# EAGLE design untitled (EAGLE 5.10)
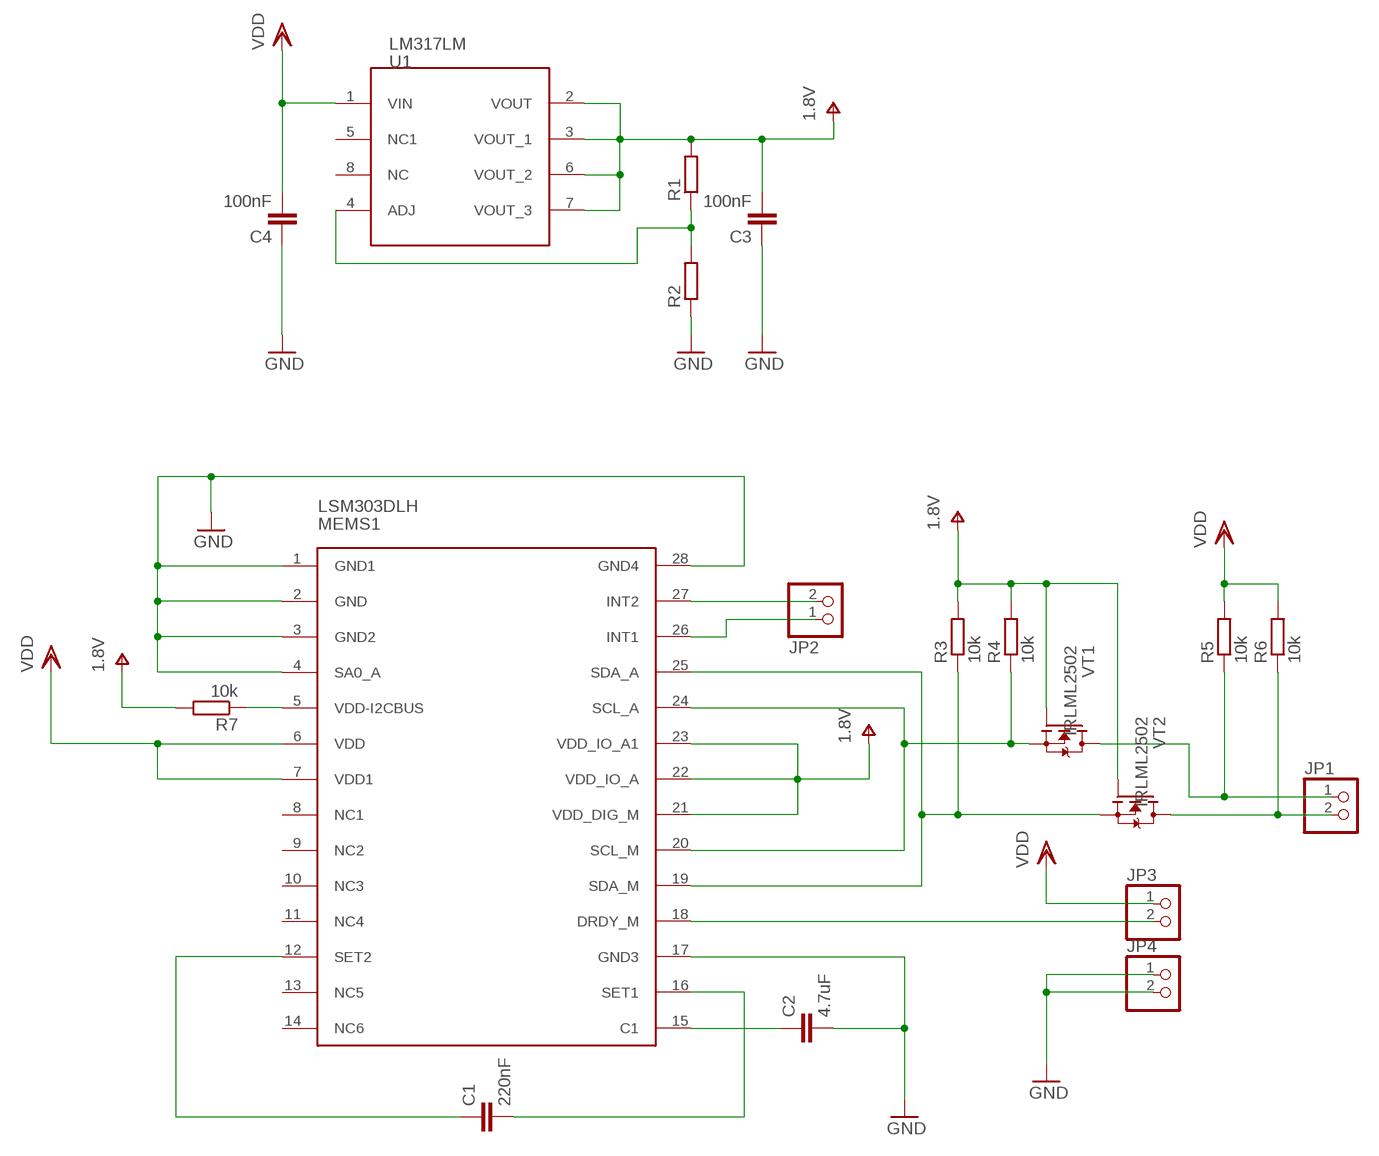
[diagram p0: schematic, sheet 1]

## Parts
C1  220nF  C-EUC1206  [C1206]
C2  4.7uF  C-EUC1206  [C1206]
C3  100nF  C-EUC1206  [C1206]
C4  100nF  C-EUC1206  [C1206]
JP1  PINHD-1X2  [1X02]
JP2  PINHD-1X2  [1X02]
JP3  PINHD-1X2  [1X02]
JP4  PINHD-1X2  [1X02]
MEMS1  LSM303DLH  [LGA28L]
R1  R-EU_R1206  [R1206]
R2  R-EU_R1206  [R1206]
R3  10k  R-EU_R1206  [R1206]
R4  10k  R-EU_R1206  [R1206]
R5  10k  R-EU_R1206  [R1206]
R6  10k  R-EU_R1206  [R1206]
R7  10k  R-EU_R1206  [R1206]
U1  LM317LM  [SO-08]
VT1  IRLML2502  [SOT23]
VT2  IRLML2502  [SOT23]

## Nets
DRDY_: JP3.2 MEMS1.18(DRDY_M)
GND: C2.2 C3.1 C4.1 JP4.1 JP4.2 MEMS1.1(GND1) MEMS1.2(GND) MEMS1.3(GND2) MEMS1.4(SA0_A) MEMS1.17(GND3) MEMS1.28(GND4) R2.1
INT1_: JP2.1 MEMS1.26(INT1)
INT2_: JP2.2 MEMS1.27(INT2)
N$2: C1.1 MEMS1.12(SET2)
N$3: C1.2 MEMS1.16(SET1)
N$4: C2.1 MEMS1.15(C1)
N$7: MEMS1.5(VDD-I2CBUS) R7.1
N$9: R1.1 R2.2 U1.4(ADJ)
N$11: MEMS1.20(SCL_M) MEMS1.24(SCL_A) R4.1 VT1.2(S)
N$13: MEMS1.19(SDA_M) MEMS1.25(SDA_A) R3.1 VT2.2(S)
SCL_: JP1.1 R5.1 VT1.3(D)
SDA_: JP1.2 R6.1 VT2.3(D)
V+: C3.2 MEMS1.21(VDD_DIG_M) MEMS1.22(VDD_IO_A) MEMS1.23(VDD_IO_A1) R1.2 R3.2 R4.2 R7.2 U1.2(VOUT) U1.3(VOUT_1) U1.6(VOUT_2) U1.7(VOUT_3) VT1.1(G) VT2.1(G) ; supply symbol labelled 1.8V
VDD: C4.2 JP3.1 MEMS1.6(VDD) MEMS1.7(VDD1) R5.2 R6.2 U1.1(VIN)
Unconnected: MEMS1.8(NC1) MEMS1.9(NC2) MEMS1.10(NC3) MEMS1.11(NC4) MEMS1.13(NC5) MEMS1.14(NC6) U1.5(NC1) U1.8(NC)

## Library data of the parts
C1-C4 = rcl:C-EU: CAPACITOR, European symbol
JP1-JP4 = pinhead:PINHD-1X2: PIN HEADER
MEMS1 = st-microelectronics:LSM303DLH
R1-R7 = rcl:R-EU_: RESISTOR, European symbol
U1 = poweric:LM317LM
VT1 VT2 = transistor-fet:IRLML2502: IRLML2502 Description These N-Channel MOSFETs from International Rectifier utilize advanced processing techniques to achieve extremely low on-resistance per silicon area. This benefit, combined with the fast switching speed and ruggedized device design that HEXFET power MOSFETs are well known for, provides the designer with an extremely efficient and reliable device for use in battery and load management. A thermally enhanced large pad leadframe has been incorporated into the standard SOT-23 package to produce Micro3 a HEXFET Power MOSFET with the industry's smallest footprint. This package, dubbed the Micro3, is ideal for applications where printed circuit board space is at a premium. The low profile (<1.1mm) of the Micro3 allows it to fit easily into extremely thin application environments such as portable electronics and PCMCIA cards. The thermal resistance and power dissipation are the best available.

## Board
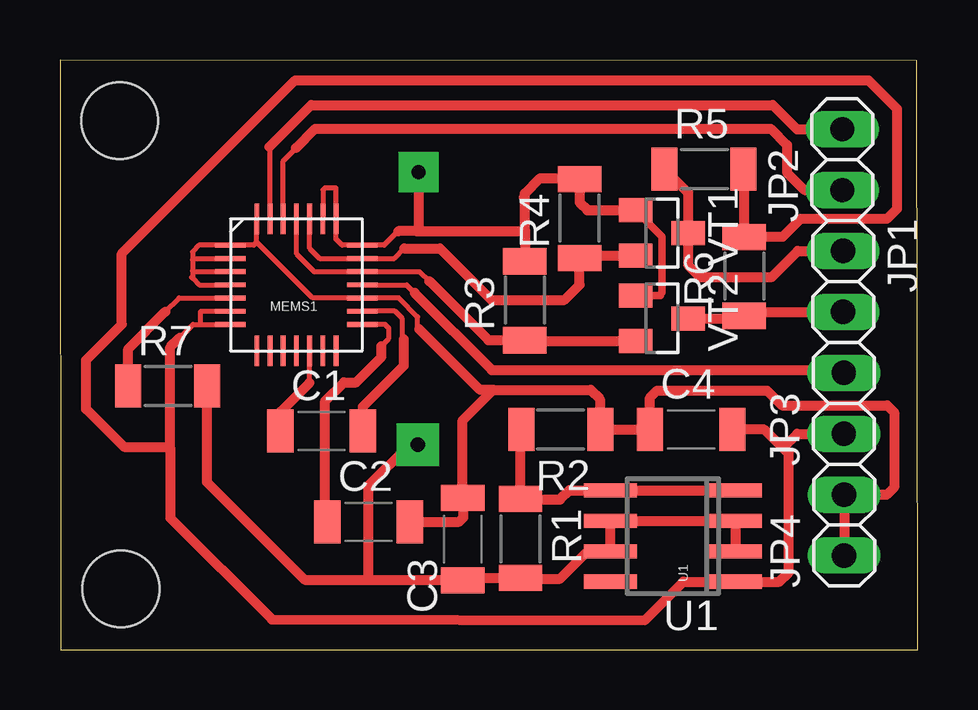
[diagram p1: board, top side]
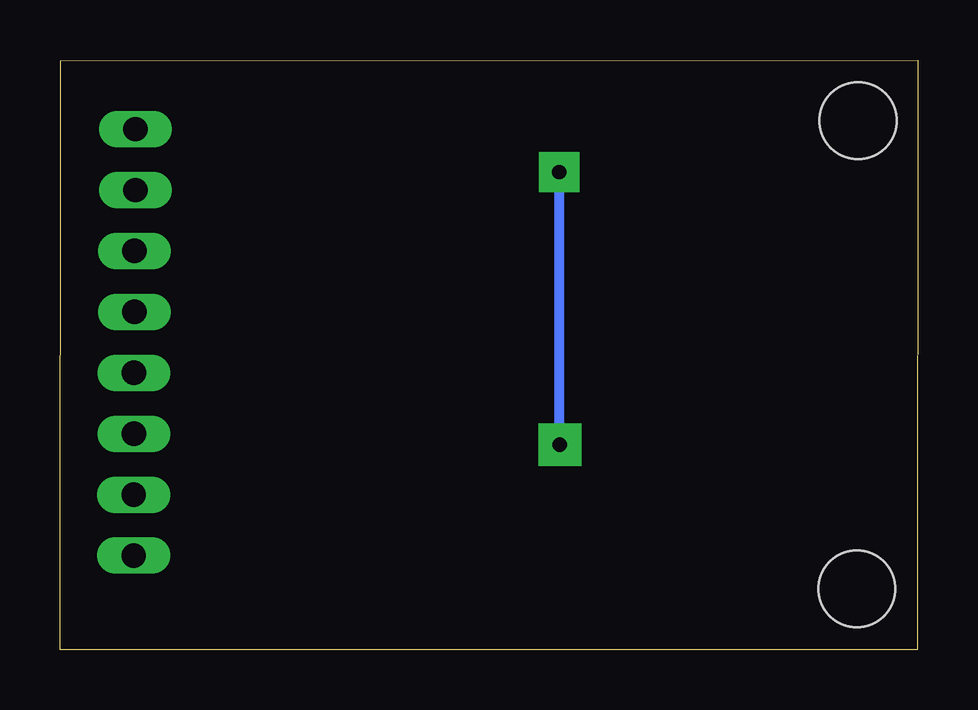
[diagram p2: board, bottom side, seen from below]

Size 35.76 x 24.59 mm. Coordinates in mm from the lower left corner, seen from the top.
Outline: 0.03,0 35.76,0 35.73,24.55 0,24.59 0.03,0
Copper layers (1*16): Top 0.035mm / dielectric 1.5mm / Bottom 0.035mm
Design rules "default": minimum track width 10mil, minimum drill 24mil, track to track 8mil, track to pad 8mil, pad to pad 8mil, via to via 8mil, smd to smd 8mil, copper to edge 40mil, drill to drill 8mil, minimum pad ring 10mil, minimum via ring 8mil, stop-mask expansion 4mil, vias tented up to drill 0mil, thermal gap 10mil
Holes 3.2 mm at 2.49,22.06 2.54,2.54

### Footprints (pad centres in the part's own frame; a part is rotated, then mirrored left to right if it is on the bottom)
C1206 = smd 1.092 x 1.8: 1 -1.718,0; 2 1.718,0
1X02 = drill 1.016 long: 1 -1.27,0; 2 1.27,0
LGA28L = smd 1.27 x 0.2: 1 -2.75,1.65; 2 -2.75,1.1; 3 -2.75,0.55; 4 -2.75,0; 5 -2.75,-0.55; 6 -2.75,-1.1; 7 -2.75,-1.65; 15 2.75,-1.65; 16 2.75,-1.1; 17 2.75,-0.55; 18 2.75,0; 19 2.75,0.55; 20 2.75,1.1; 21 2.75,1.65 | smd 0.2 x 1.27: 8 -1.65,-2.75; 9 -1.1,-2.75; 10 -0.55,-2.75; 11 0,-2.75; 12 0.55,-2.75; 13 1.1,-2.75; 14 1.65,-2.75; 22 1.65,2.75; 23 1.1,2.75; 24 0.55,2.75; 25 0,2.75; 26 -0.55,2.75; 27 -1.1,2.75; 28 -1.65,2.75
R1206 = smd 1.092 x 1.803: 1 -1.676,0; 2 1.613,0
SO-08 = smd 0.6 x 2.2: 1 -1.905,-2.6; 2 -0.635,-2.6; 3 0.635,-2.6; 4 1.905,-2.6; 5 1.905,2.6; 6 0.635,2.6; 7 -0.635,2.6; 8 -1.905,2.6
SOT23 = smd 1 x 1.4: 1 -0.95,-1.1; 2 0.95,-1.1; 3 0,1.1

### Placement (x,y rotation side)
C1  10.91,9.12 0 top
C2  12.87,5.33 0 top
C3  16.79,4.61 270 top
C4  26.31,9.18 0 top
JP1  32.65,15.35 270 top
JP2  32.61,20.43 90 top
JP3  32.68,10.27 90 top
JP4  32.69,5.19 90 top
MEMS1  9.86,15.21 0 top
R1  19.2,4.61 270 top
R2  20.85,9.18 180 top
R3  19.38,14.58 90 top
R4  21.67,18.01 90 top
R5  26.87,20.04 0 top
R6  28.52,15.6 90 top
R7  4.52,11 0 top
U1  25.55,4.74 90 top
VT1  25.1,17.37 270 top
VT2  25.1,13.82 270 top

### Tracks (layer width: path | path; a pad name or v marks a point on that pad's centre or on a via)
DRDY_
  Top 0.203: MEMS1.18 14.45,15.21 14.78,14.87
  Top 0.406: 14.78,14.87 18.01,11.66 32.56,11.66 JP3.2
GND
  Top 0.203: 8.21,16.99 MEMS1.28 | 8.21,16.99 8.08,16.87 MEMS1.1 5.79,16.86 5.52,16.6 5.52,16.26 | 8.21,16.99 10.53,14.66 MEMS1.17 14.13,14.66 14.91,13.88 14.91,13.44 14.99,13.36 | MEMS1.4 5.8,15.21 5.52,15.49 | 5.52,16.26 5.52,15.8 | 5.52,15.8 5.52,15.49 | MEMS1.2 5.58,16.32 5.52,16.26 | MEMS1.3 5.56,15.77 5.52,15.8 | 5.52,15.49 5.49,15.53
  Top 0.406: 18.06,10.83 16.79,9.56 C3.1 16.81,6.3 16.81,5.51 16.64,5.33 C2.2 | 18.06,10.83 22.12,10.83 22.5,10.45 22.5,9.21 R2.1 C4.1 24.6,10.51 24.89,10.81 29.48,10.81 30.1,10.19 34.48,10.19 34.77,9.89 34.77,6.77 34.47,6.46 JP4.2 JP4.1 | 18.06,10.83 17.51,10.83 14.99,13.36
INT1_
  Top 0.203: MEMS1.26 9.31,20.38 9.84,20.92
  Top 0.406: JP2.1 31.04,19.16 30.3,19.9 30.3,21.04 29.63,21.72 10.64,21.72 9.84,20.92
INT2_
  Top 0.203: MEMS1.27 8.76,20.95 8.74,20.97
  Top 0.406: JP2.2 30.72,21.7 29.72,22.71 10.48,22.71 8.74,20.97
N$2
  Top 0.203: MEMS1.12 10.41,11.13 10.4,11.12
  Top 0.406: C1.1 9.19,9.92 10.41,11.13
N$3
  Top 0.203: MEMS1.16 13.97,14.12 14.27,13.8 14.27,13.11 14.34,12.94
  Top 0.406: C1.2 12.63,10.14 14.34,11.85 14.34,12.94
N$4
  Top 0.203: MEMS1.15 13.55,13.56 13.72,13.4 13.72,12.98 13.4,12.66
  Top 0.406: 13.4,12.66 13.4,12.21 12.34,11.15 11.84,11.15 11.06,10.38 11.06,5.42 C2.1
N$7
  Top 0.203: MEMS1.5 4.96,14.66 4.39,14.1
  Top 0.406: R7.1 2.85,12.55 4.39,14.1
N$9
  Top 0.406: R2.2 19.2,9.18 R1.1 19.23,6.26 20.85,6.26 21.23,6.64 U1.4
N$11
  Top 0.203: 14.35,16.73 13.94,16.32 MEMS1.20 10.83,16.32 10.41,16.73 MEMS1.24
  Top 0.406: VT1.2 21.76,16.42 R4.1 21.67,15.21 21.03,14.58 17.98,14.58 15.84,16.73 14.35,16.73
N$13
  Top 0.203: MEMS1.25 9.87,17.95 9.87,16.5 10.6,15.77 MEMS1.19 14.99,15.77 15.41,15.37
  Top 0.406: VT2.2 19.42,12.87 R3.1 17.86,12.9 15.41,15.37
SCL_
  Top 0.406: R5.1 26.2,19.04 VT1.3 26.19,16.04 26.68,15.54 29.68,15.54 30.76,16.62 JP1.1
SDA_
  Top 0.406: VT2.3 28.42,13.82 R6.1 28.69,14.08 JP1.2
V+  (via drill 0.6 pad 1.68, 0.6 pad 1.78)
  Top 0.203: 14.1,17.45 13.51,16.86 MEMS1.21 11.76,16.86 11.51,17.12 MEMS1.22 11.51,19.25 11.05,19.25 10.96,19.16 MEMS1.23 | C3.2 16.77,2.87
  Top 0.305: VT2.1 25.03,14.77 25.1,14.9 25.1,17.22 VT1.1
  Top 0.406: U1.2 U1.3 U1.6 U1.7 22,4.1 20.85,2.96 19.24,2.96 R1.2 16.89,3 C3.2 16.76,2.92 12.87,2.92 | VT1.1 21.99,18.32 21.67,18.64 R4.2 21.63,19.66 20.02,19.66 19.38,19.02 19.38,18.9 | 19.38,17.51 19.38,18.9 | 19.38,17.51 R3.2 | 19.38,18.9 19.34,18.86 | 14.88,17.45 14.1,17.45 | 14.88,17.45 19.32,17.45 19.38,17.51 | R7.2 6.13,6.99 10.2,2.92 12.87,2.92 | v14.92,8.55 14.57,8.55 12.87,6.84 12.87,2.92 | v14.95,19.91 14.95,17.51 14.88,17.45
  Bottom 0.406: v14.95,19.91 14.95,8.57 v14.92,8.55
VDD
  Top 0.203: 5.84,13.56 5.55,13.56 4.99,13.01 | 5.84,13.56 MEMS1.7 | MEMS1.6 5.89,14.12 5.85,14.08 5.85,13.58 5.84,13.56
  Top 0.406: 30.38,7.76 30.38,3.21 30,2.83 U1.1 25.98,2.83 24.38,1.23 8.84,1.26 4.6,5.49 4.6,8.38 | 30.38,7.76 30.38,8.17 30.14,8.41 | 30.14,8.41 29.36,9.18 C4.2 | R5.2 28.52,20 R6.2 30.12,17.21 30.87,17.96 34.47,17.96 34.89,18.38 34.89,22.55 33.71,23.74 9.8,23.74 2.58,16.51 2.58,13.56 1.09,12.08 1.09,10.03 2.67,8.46 4.52,8.46 4.6,8.38 | 30.38,7.76 30.4,7.79 | 4.6,8.38 4.6,12.61 4.99,13.01 | 30.14,8.41 30.73,9 JP3.1 32.7,8.98